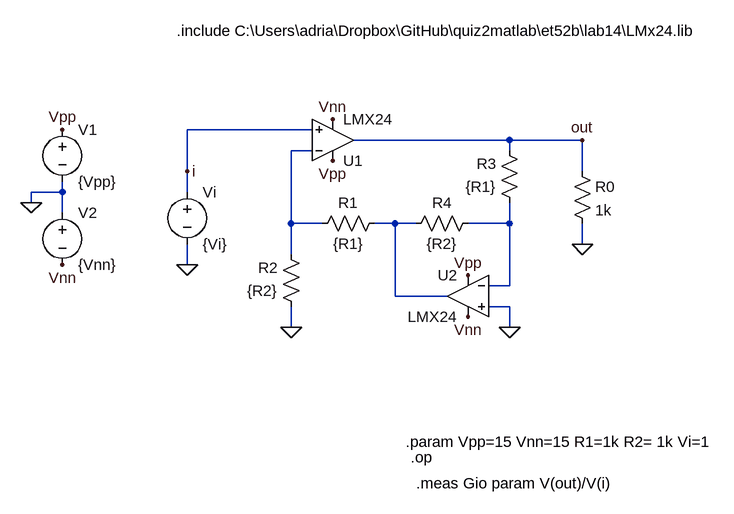
[diagram p0: schematic lab14a.asc]
lab14a.asc, the LTspice schematic file:
Version 4
SHEET 1 988 680
WIRE -256 96 -448 96
WIRE 48 112 -192 112
WIRE 160 112 48 112
WIRE -256 128 -288 128
WIRE 48 128 48 112
WIRE -448 160 -448 96
WIRE 160 160 160 112
WIRE -640 192 -640 176
WIRE -640 192 -688 192
WIRE -448 192 -448 160
WIRE -688 208 -688 192
WIRE -640 224 -640 192
WIRE -288 240 -288 128
WIRE -240 240 -288 240
WIRE -128 240 -160 240
WIRE -96 240 -128 240
WIRE 48 240 48 208
WIRE 48 240 -16 240
WIRE 160 272 160 240
WIRE -288 288 -288 240
WIRE -448 304 -448 272
WIRE 48 336 48 240
WIRE 48 336 16 336
WIRE -128 352 -128 240
WIRE -48 352 -128 352
WIRE 48 368 16 368
WIRE -288 400 -288 368
WIRE 48 400 48 368
FLAG -688 208 0
FLAG -640 96 Vpp
FLAG -640 304 Vnn
FLAG -448 304 0
FLAG 160 112 out
FLAG 160 272 0
FLAG -448 160 i
FLAG -288 400 0
FLAG -16 320 Vpp
FLAG 48 400 0
FLAG -224 80 Vnn
FLAG -16 384 Vnn
FLAG -224 144 Vpp
SYMBOL Opamps\\opamp2 -224 176 M180
SYMATTR InstName U1
SYMATTR Value LMX24
SYMBOL voltage -640 80 R0
SYMATTR InstName V1
SYMATTR Value {Vpp}
SYMBOL voltage -640 208 R0
SYMATTR InstName V2
SYMATTR Value {Vnn}
SYMBOL voltage -448 176 R0
SYMATTR InstName Vi
SYMATTR Value {Vi}
SYMBOL res 144 144 R0
SYMATTR InstName R0
SYMATTR Value 1k
SYMBOL res -144 224 R90
WINDOW 0 0 56 VBottom 2
WINDOW 3 32 56 VTop 2
SYMATTR InstName R1
SYMATTR Value {R1}
SYMBOL res -272 384 R180
WINDOW 0 36 76 Left 2
WINDOW 3 36 40 Left 2
SYMATTR InstName R2
SYMATTR Value {R2}
SYMBOL Opamps\\opamp2 -16 288 M0
SYMATTR InstName U2
SYMATTR Value LMX24
SYMBOL res 64 224 R180
WINDOW 0 36 76 Left 2
WINDOW 3 36 40 Left 2
SYMATTR InstName R3
SYMATTR Value {R1}
SYMBOL res 0 224 R90
WINDOW 0 0 56 VBottom 2
WINDOW 3 32 56 VTop 2
SYMATTR InstName R4
SYMATTR Value {R2}
TEXT -464 -56 Left 2 !.include C:\\Users\\adria\\Dropbox\\GitHub\\quiz2matlab\\et52b\\lab14\\LMx24.lib
TEXT -112 576 Left 2 !.param Vpp=15 Vnn=15 R1=1k R2= 1k Vi=1
TEXT -104 600 Left 2 !.op
TEXT -96 640 Left 2 !.meas Gio param V(out)/V(i)

The netlist it stands for:
* lab14a.asc
XU1 i N001 Vpp Vnn out LMX24  ; pins In+ In- V+ V- OUT
V1 Vpp 0 {Vpp}
V2 0 Vnn {Vnn}
Vi i 0 {Vi}
R0 out 0 1k
R1 N002 N001 {R1}
R2 0 N001 {R2}
XU2 0 N003 Vpp Vnn N002 LMX24  ; pins In+ In- V+ V- OUT
R3 N003 out {R1}
R4 N003 N002 {R2}
.include C:\Users\adria\Dropbox\GitHub\quiz2matlab\et52b\lab14\LMx24.lib
.param Vpp=15 Vnn=15 R1=1k R2= 1k Vi=1
.op
.meas Gio param V(out)/V(i)
.backanno
.end